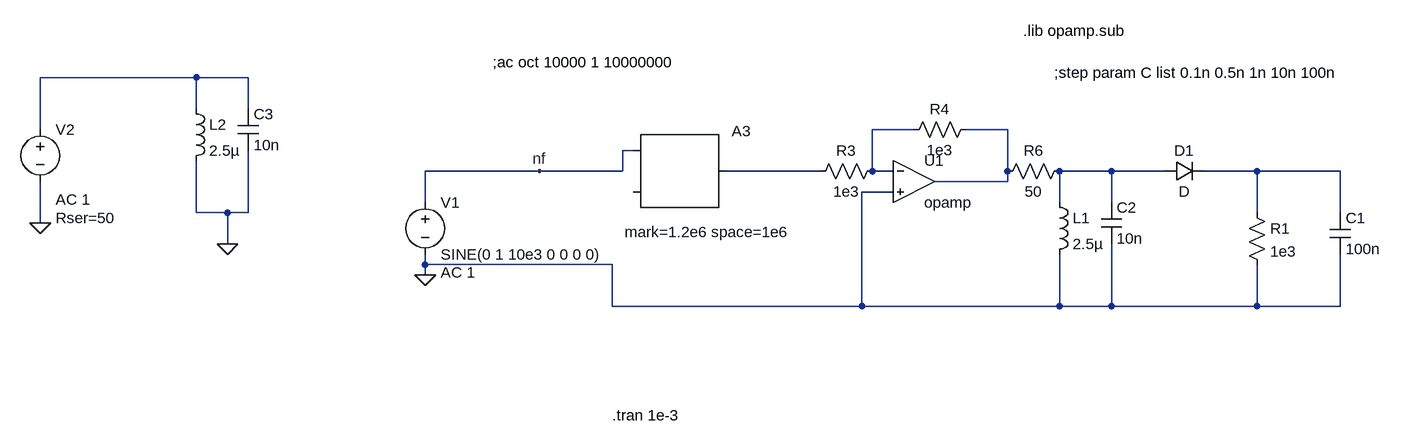
[diagram p0: schematic Freq_Demod_raw_SS25.asc]
Freq_Demod_raw_SS25.asc, the LTspice schematic file:
Version 4.1
SHEET 1 2240 680
WIRE -624 -112 -864 -112
WIRE -544 -112 -624 -112
WIRE -624 -64 -624 -112
WIRE -544 -64 -544 -112
WIRE -864 -32 -864 -112
WIRE 480 -32 416 -32
WIRE 624 -32 560 -32
WIRE 48 0 32 0
WIRE -96 32 -272 32
WIRE 32 32 32 0
WIRE 32 32 -96 32
WIRE 336 32 192 32
WIRE 416 32 416 -32
WIRE 448 32 416 32
WIRE 624 32 624 -32
WIRE 784 32 704 32
WIRE 864 32 784 32
WIRE 1008 32 928 32
WIRE 1136 32 1008 32
WIRE 624 48 624 32
WIRE 624 48 512 48
WIRE 448 64 400 64
WIRE -272 80 -272 32
WIRE 704 80 704 32
WIRE 784 80 784 32
WIRE -624 96 -624 16
WIRE -576 96 -624 96
WIRE -544 96 -544 0
WIRE -544 96 -576 96
WIRE 1008 96 1008 32
WIRE 1136 96 1136 32
WIRE -864 112 -864 48
WIRE -576 144 -576 96
WIRE -272 176 -272 160
WIRE 16 176 -272 176
WIRE -272 192 -272 176
WIRE 16 240 16 176
WIRE 400 240 400 64
WIRE 400 240 16 240
WIRE 704 240 704 160
WIRE 704 240 400 240
WIRE 784 240 784 144
WIRE 784 240 704 240
WIRE 1008 240 1008 176
WIRE 1008 240 784 240
WIRE 1136 240 1136 160
WIRE 1136 240 1008 240
FLAG -272 192 0
FLAG -96 32 nf
FLAG -864 112 0
FLAG -576 144 0
SYMBOL voltage -272 64 R0
WINDOW 123 24 124 Left 2
WINDOW 39 24 152 Left 2
SYMATTR Value2 AC 1
SYMATTR InstName V1
SYMATTR Value SINE(0 1 10e3 0 0 0 0)
SYMBOL diode 864 48 R270
WINDOW 0 32 32 VTop 2
WINDOW 3 0 32 VBottom 2
SYMATTR InstName D1
SYMBOL res 992 80 R0
SYMATTR InstName R1
SYMATTR Value 1e3
SYMBOL cap 1120 96 R0
SYMATTR InstName C1
SYMATTR Value 100n
SYMBOL ind 688 64 R0
SYMATTR InstName L1
SYMATTR Value 2.5µ
SYMBOL cap 768 80 R0
SYMATTR InstName C2
SYMATTR Value 10n
SYMBOL modulate 48 0 R0
WINDOW 3 -13 126 Left 2
SYMATTR Value mark=1.2e6 space=1e6
SYMATTR InstName A3
SYMBOL opamp 480 -16 R0
SYMATTR InstName U1
SYMBOL res 432 16 R90
WINDOW 0 0 56 VBottom 2
WINDOW 3 32 56 VTop 2
SYMATTR InstName R3
SYMATTR Value 1e3
SYMBOL res 464 -16 R270
WINDOW 0 32 56 VTop 2
WINDOW 3 0 56 VBottom 2
SYMATTR InstName R4
SYMATTR Value 1e3
SYMBOL res 720 16 R90
WINDOW 0 0 56 VBottom 2
WINDOW 3 32 56 VTop 2
SYMATTR InstName R6
SYMATTR Value 50
SYMBOL ind -640 -80 R0
SYMATTR InstName L2
SYMATTR Value 2.5µ
SYMBOL cap -560 -64 R0
SYMATTR InstName C3
SYMATTR Value 10n
SYMBOL voltage -864 -48 R0
WINDOW 123 24 124 Left 2
WINDOW 39 24 152 Left 2
SYMATTR Value2 AC 1
SYMATTR SpiceLine Rser=50
SYMATTR InstName V2
SYMATTR Value ""
TEXT 16 408 Left 2 !.tran 1e-3
TEXT 696 -120 Left 2 !;step param C list 0.1n 0.5n 1n 10n 100n
TEXT 648 -184 Left 2 !.lib opamp.sub
TEXT -168 -136 Left 2 !;ac oct 10000 1 10000000

The netlist it stands for:
* Freq_Demod_raw_SS25.asc
V1 nf 0 SINE(0 1 10e3 0 0 0 0) AC 1
D1 N005 N006 D
R1 N006 0 1e3
C1 N006 0 100n
L1 N005 0 2.5µ
C2 N005 0 10n
A3 nf 0 0 0 0 0 N004 0 MODULATOR mark=1.2e6 space=1e6
X§U1 N002 0 N003 opamp Aol=100K GBW=10Meg  ; pins invin noninvin out
R3 N002 N004 1e3
R4 N002 N003 1e3
R6 N005 N003 50
L2 N001 0 2.5µ
C3 N001 0 10n
V2 N001 0 AC 1 Rser=50
.model D D
.lib standard.dio
.tran 1e-3
;step param C list 0.1n 0.5n 1n 10n 100n
.lib opamp.sub
;ac oct 10000 1 10000000
.backanno
.end